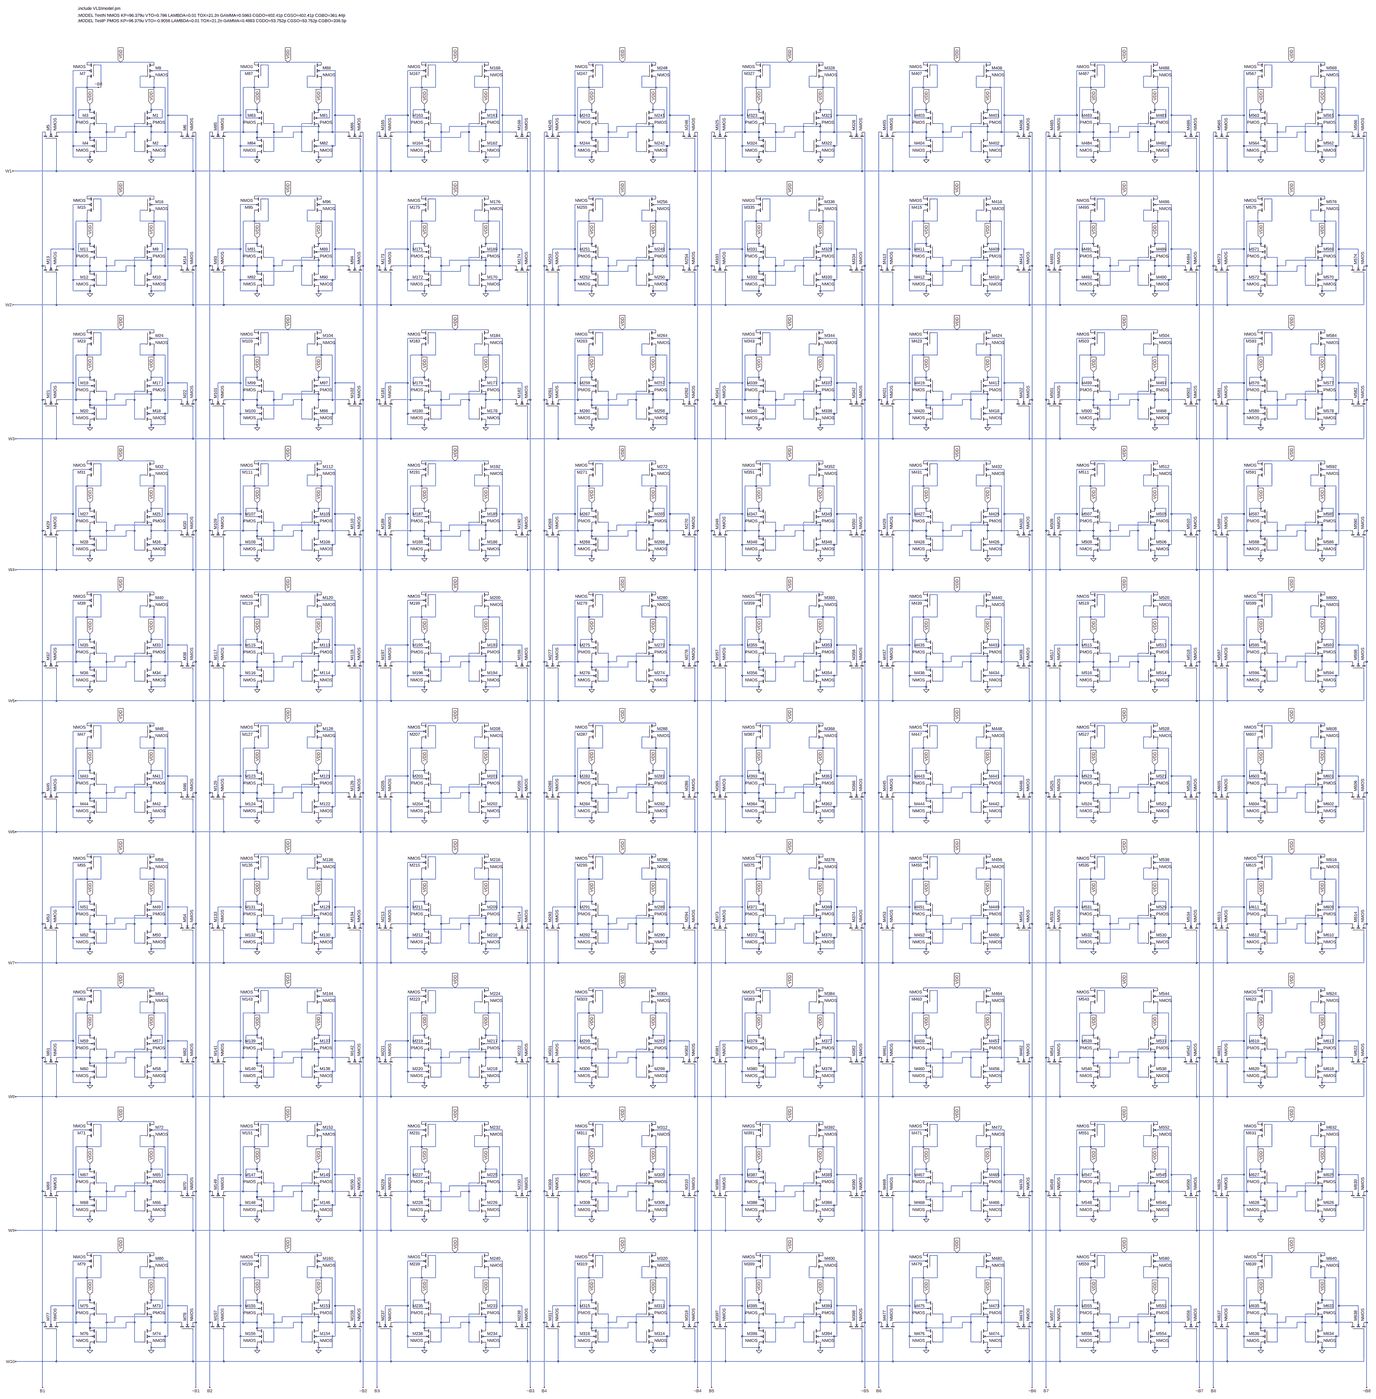
[diagram p0: schematic 40nm RAM - Copy.asc, whole sheet]
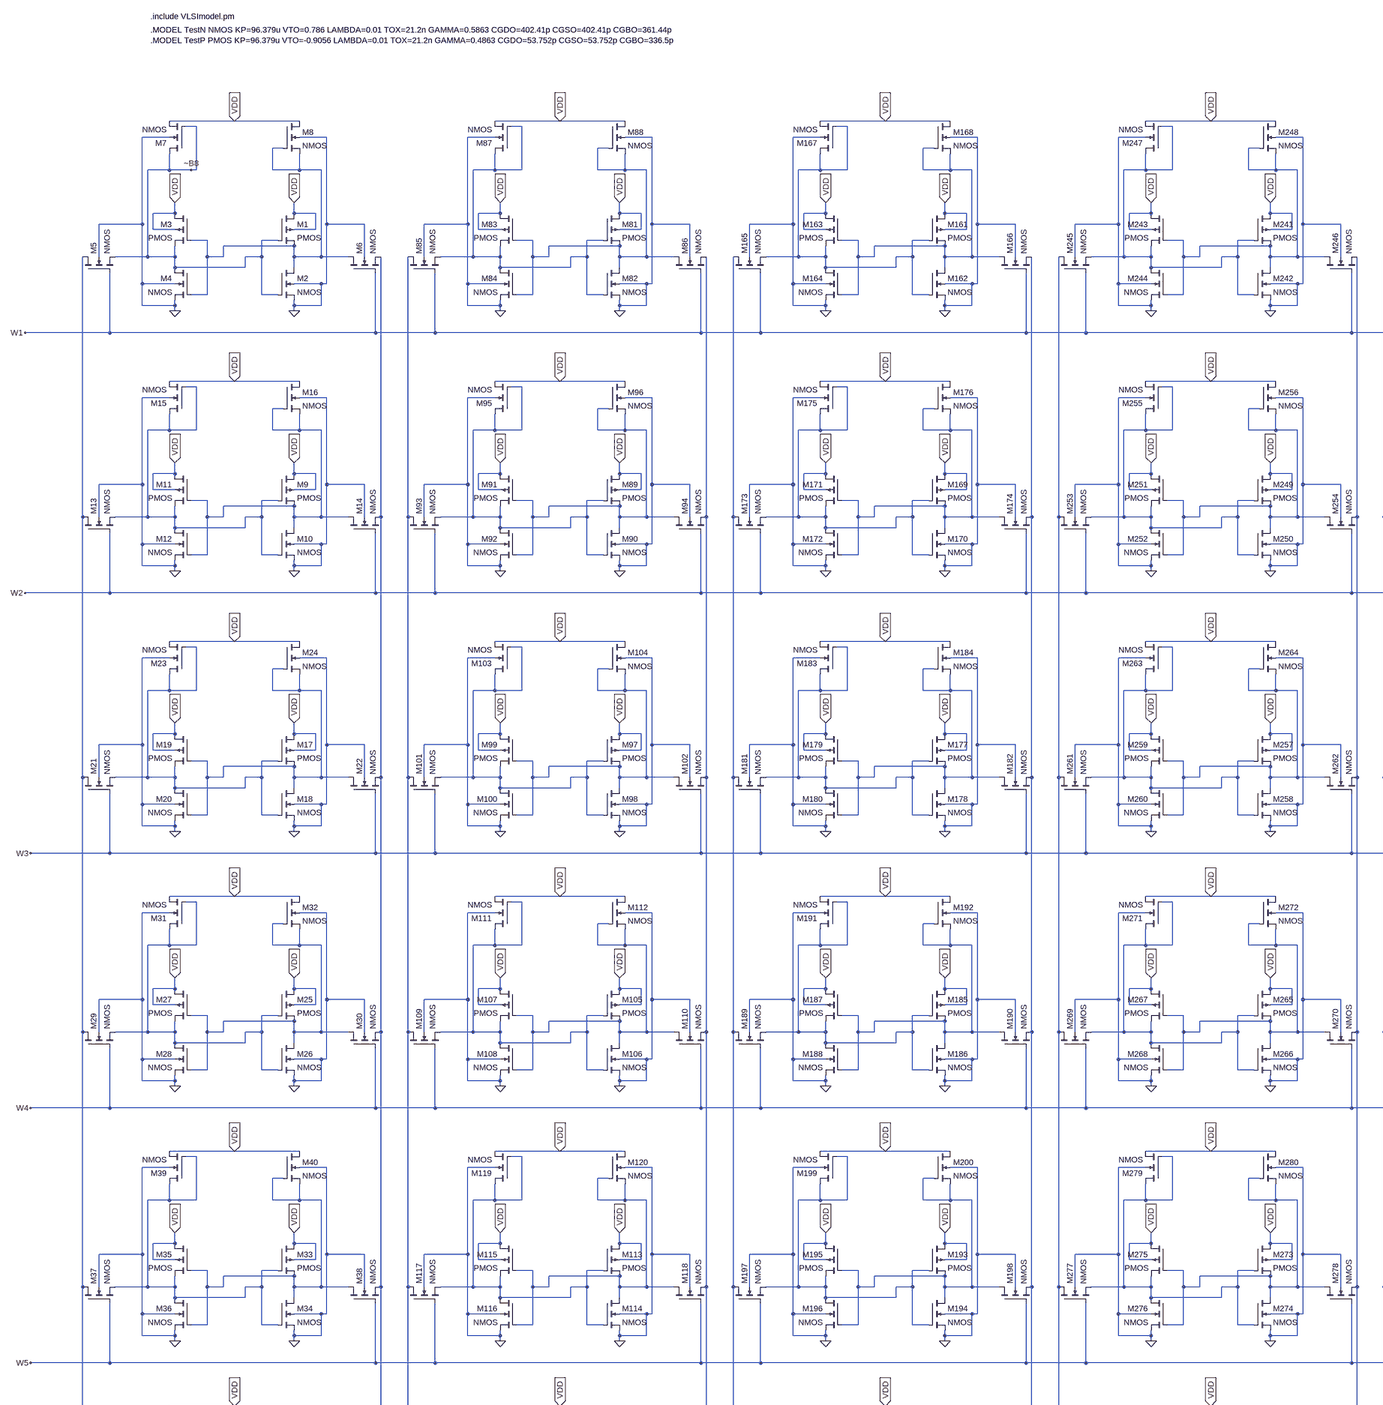
[diagram p1: schematic 40nm RAM - Copy.asc, part, row 1 of 2, column 1 of 2]
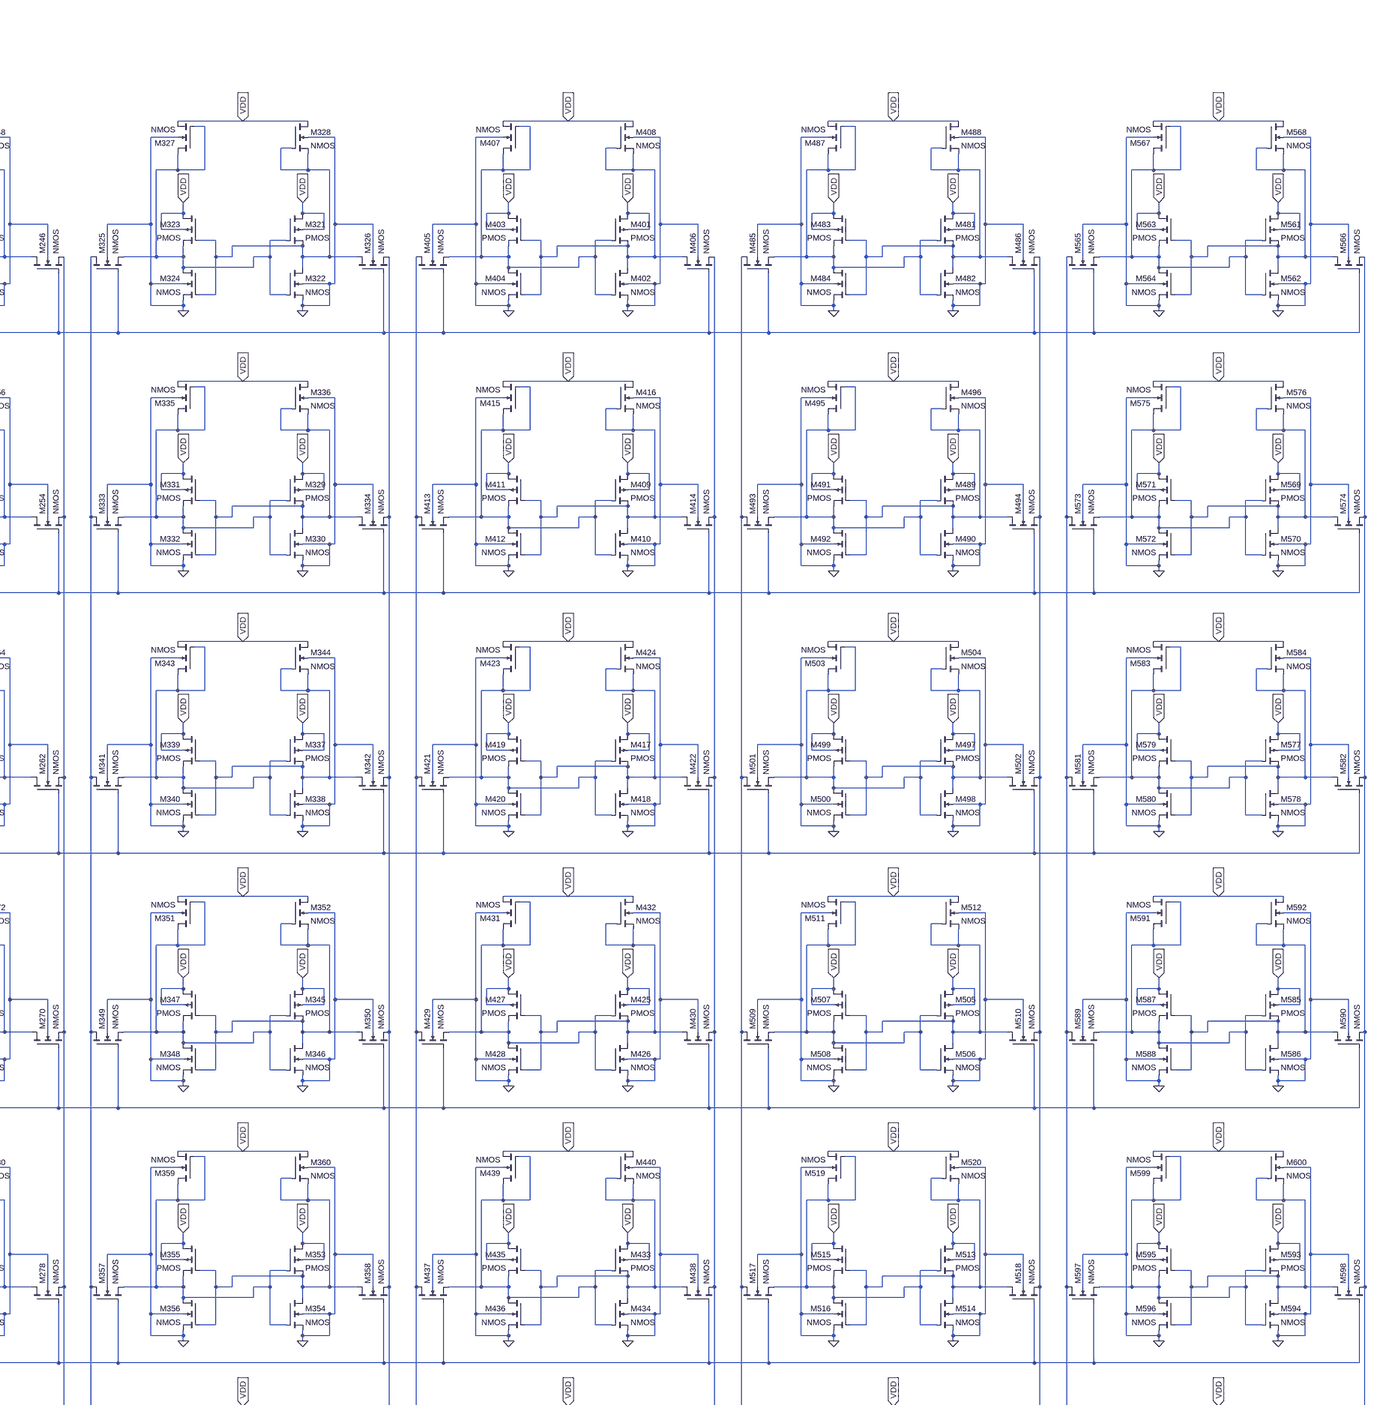
[diagram p2: schematic 40nm RAM - Copy.asc, part, row 1 of 2, column 2 of 2]
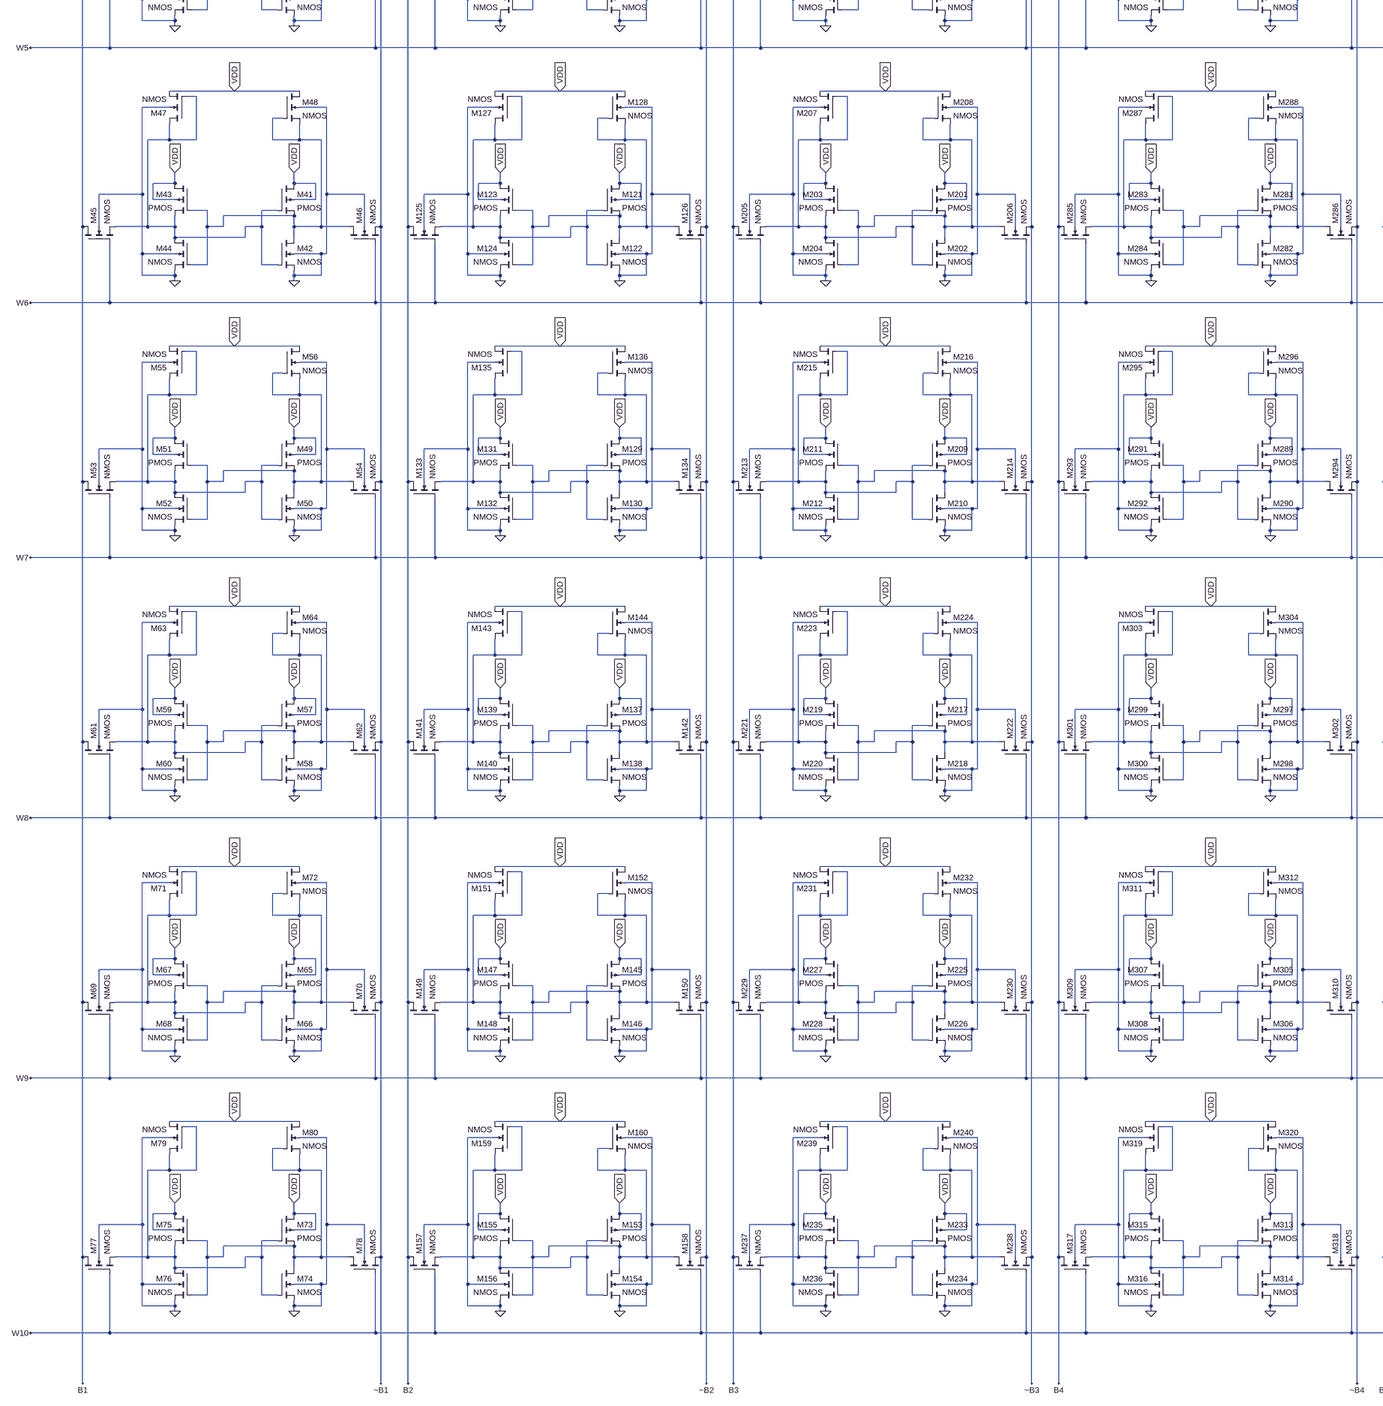
[diagram p3: schematic 40nm RAM - Copy.asc, part, row 2 of 2, column 1 of 2]
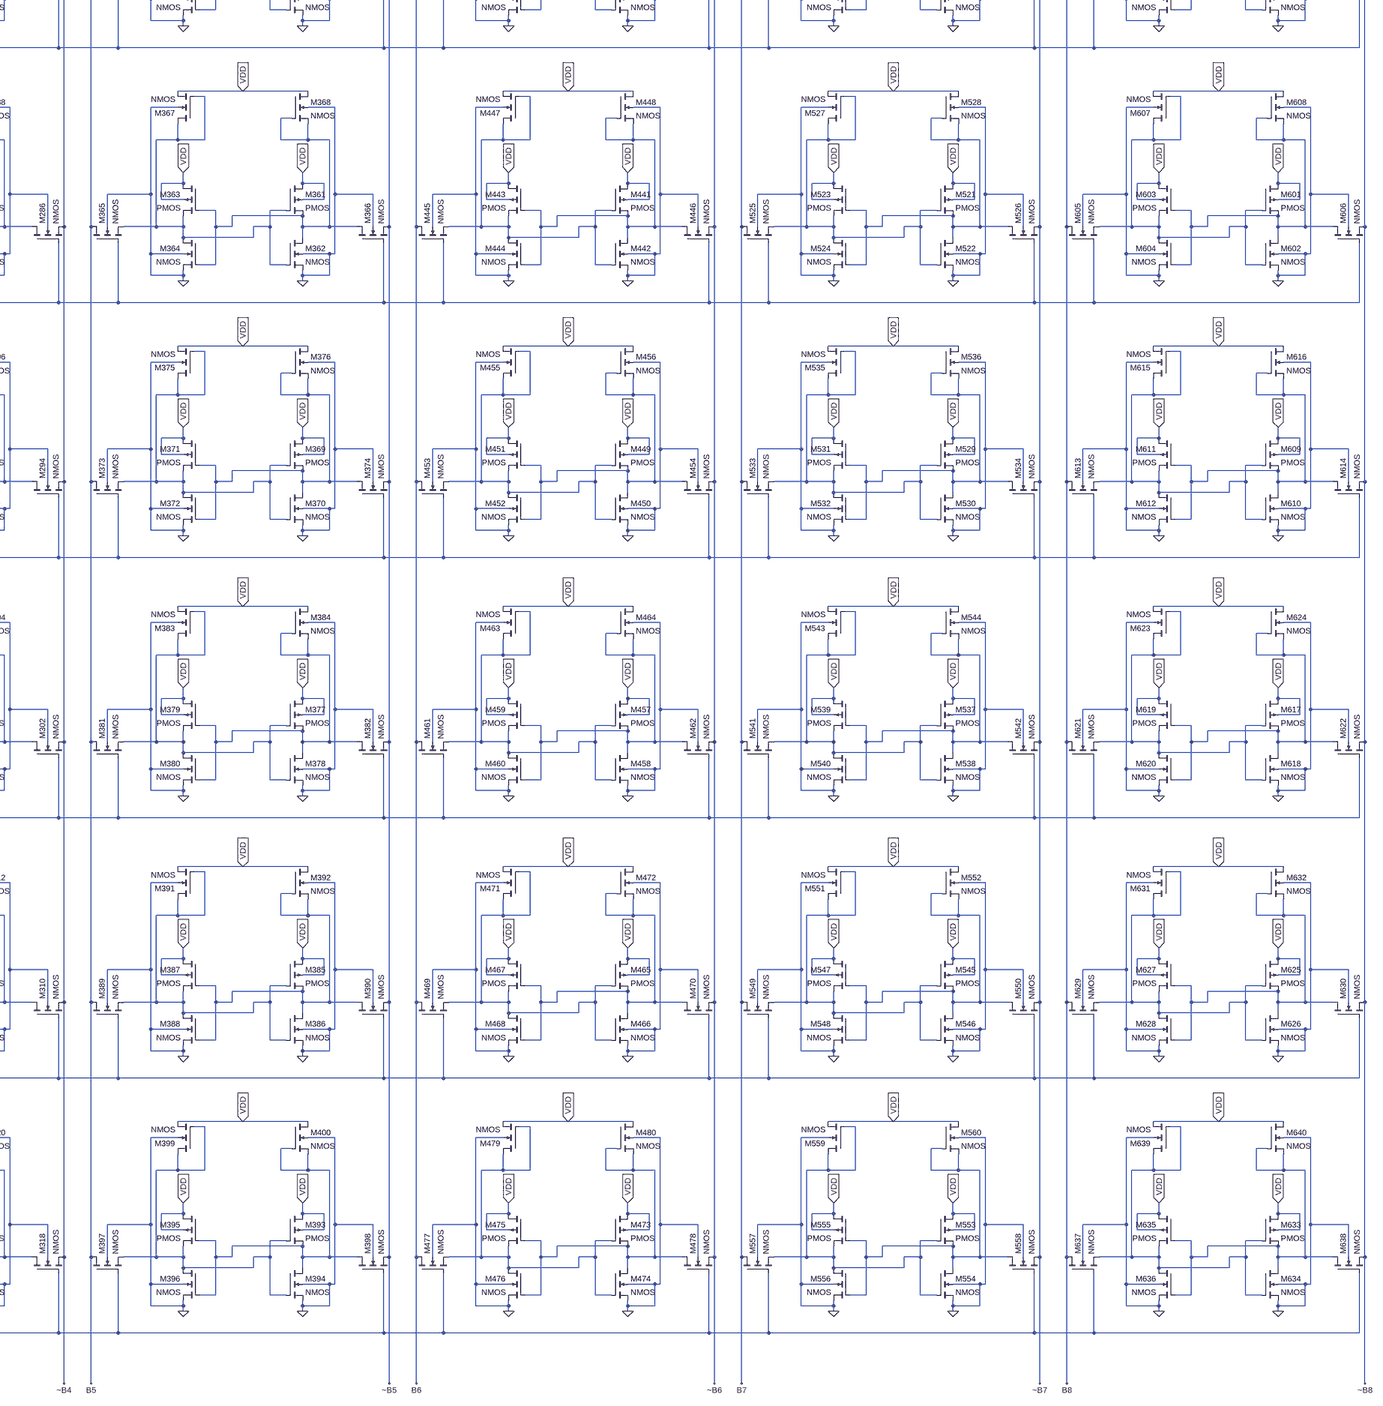
[diagram p4: schematic 40nm RAM - Copy.asc, part, row 2 of 2, column 2 of 2]
* 40nm RAM - Copy.asc
M1 VDD ~B8 N008 VDD PMOS
M2 N008 ~B8 0 0 NMOS
M3 VDD N008 ~B8 VDD PMOS
M4 ~B8 N008 0 0 NMOS
M5 B1 W1 ~B8 0 NMOS
M6 N008 W1 ~B1 0 NMOS
M7 ~B8 ~B8 VDD 0 NMOS
M8 VDD N008 N008 0 NMOS
M9 VDD N016 N024 VDD PMOS
M10 N024 N016 0 0 NMOS
M11 VDD N024 N016 VDD PMOS
M12 N016 N024 0 0 NMOS
M13 B1 W2 N016 0 NMOS
M14 N024 W2 ~B1 0 NMOS
M15 N016 N016 VDD 0 NMOS
M16 VDD N024 N024 0 NMOS
M17 VDD N032 N040 VDD PMOS
M18 N040 N032 0 0 NMOS
M19 VDD N040 N032 VDD PMOS
M20 N032 N040 0 0 NMOS
M21 B1 W3 N032 0 NMOS
M22 N040 W3 ~B1 0 NMOS
M23 N032 N032 VDD 0 NMOS
M24 VDD N040 N040 0 NMOS
M25 VDD N048 N056 VDD PMOS
M26 N056 N048 0 0 NMOS
M27 VDD N056 N048 VDD PMOS
M28 N048 N056 0 0 NMOS
M29 B1 W4 N048 0 NMOS
M30 N056 W4 ~B1 0 NMOS
M31 N048 N048 VDD 0 NMOS
M32 VDD N056 N056 0 NMOS
M33 VDD N064 N072 VDD PMOS
M34 N072 N064 0 0 NMOS
M35 VDD N072 N064 VDD PMOS
M36 N064 N072 0 0 NMOS
M37 B1 W5 N064 0 NMOS
M38 N072 W5 ~B1 0 NMOS
M39 N064 N064 VDD 0 NMOS
M40 VDD N072 N072 0 NMOS
M41 VDD N080 N088 VDD PMOS
M42 N088 N080 0 0 NMOS
M43 VDD N088 N080 VDD PMOS
M44 N080 N088 0 0 NMOS
M45 B1 W6 N080 0 NMOS
M46 N088 W6 ~B1 0 NMOS
M47 N080 N080 VDD 0 NMOS
M48 VDD N088 N088 0 NMOS
M49 VDD N096 N104 VDD PMOS
M50 N104 N096 0 0 NMOS
M51 VDD N104 N096 VDD PMOS
M52 N096 N104 0 0 NMOS
M53 B1 W7 N096 0 NMOS
M54 N104 W7 ~B1 0 NMOS
M55 N096 N096 VDD 0 NMOS
M56 VDD N104 N104 0 NMOS
M57 VDD N112 N120 VDD PMOS
M58 N120 N112 0 0 NMOS
M59 VDD N120 N112 VDD PMOS
M60 N112 N120 0 0 NMOS
M61 B1 W8 N112 0 NMOS
M62 N120 W8 ~B1 0 NMOS
M63 N112 N112 VDD 0 NMOS
M64 VDD N120 N120 0 NMOS
M65 VDD N128 N136 VDD PMOS
M66 N136 N128 0 0 NMOS
M67 VDD N136 N128 VDD PMOS
M68 N128 N136 0 0 NMOS
M69 B1 W9 N128 0 NMOS
M70 N136 W9 ~B1 0 NMOS
M71 N128 N128 VDD 0 NMOS
M72 VDD N136 N136 0 NMOS
M73 VDD N144 N152 VDD PMOS
M74 N152 N144 0 0 NMOS
M75 VDD N152 N144 VDD PMOS
M76 N144 N152 0 0 NMOS
M77 B1 W10 N144 0 NMOS
M78 N152 W10 ~B1 0 NMOS
M79 N144 N144 VDD 0 NMOS
M80 VDD N152 N152 0 NMOS
M81 VDD N001 N009 VDD PMOS
M82 N009 N001 0 0 NMOS
M83 VDD N009 N001 VDD PMOS
M84 N001 N009 0 0 NMOS
M85 B2 W1 N001 0 NMOS
M86 N009 W1 ~B2 0 NMOS
M87 N001 N001 VDD 0 NMOS
M88 VDD N009 N009 0 NMOS
M89 VDD N017 N025 VDD PMOS
M90 N025 N017 0 0 NMOS
M91 VDD N025 N017 VDD PMOS
M92 N017 N025 0 0 NMOS
M93 B2 W2 N017 0 NMOS
M94 N025 W2 ~B2 0 NMOS
M95 N017 N017 VDD 0 NMOS
M96 VDD N025 N025 0 NMOS
M97 VDD N033 N041 VDD PMOS
M98 N041 N033 0 0 NMOS
M99 VDD N041 N033 VDD PMOS
M100 N033 N041 0 0 NMOS
M101 B2 W3 N033 0 NMOS
M102 N041 W3 ~B2 0 NMOS
M103 N033 N033 VDD 0 NMOS
M104 VDD N041 N041 0 NMOS
M105 VDD N049 N057 VDD PMOS
M106 N057 N049 0 0 NMOS
M107 VDD N057 N049 VDD PMOS
M108 N049 N057 0 0 NMOS
M109 B2 W4 N049 0 NMOS
M110 N057 W4 ~B2 0 NMOS
M111 N049 N049 VDD 0 NMOS
M112 VDD N057 N057 0 NMOS
M113 VDD N065 N073 VDD PMOS
M114 N073 N065 0 0 NMOS
M115 VDD N073 N065 VDD PMOS
M116 N065 N073 0 0 NMOS
M117 B2 W5 N065 0 NMOS
M118 N073 W5 ~B2 0 NMOS
M119 N065 N065 VDD 0 NMOS
M120 VDD N073 N073 0 NMOS
M121 VDD N081 N089 VDD PMOS
M122 N089 N081 0 0 NMOS
M123 VDD N089 N081 VDD PMOS
M124 N081 N089 0 0 NMOS
M125 B2 W6 N081 0 NMOS
M126 N089 W6 ~B2 0 NMOS
M127 N081 N081 VDD 0 NMOS
M128 VDD N089 N089 0 NMOS
M129 VDD N097 N105 VDD PMOS
M130 N105 N097 0 0 NMOS
M131 VDD N105 N097 VDD PMOS
M132 N097 N105 0 0 NMOS
M133 B2 W7 N097 0 NMOS
M134 N105 W7 ~B2 0 NMOS
M135 N097 N097 VDD 0 NMOS
M136 VDD N105 N105 0 NMOS
M137 VDD N113 N121 VDD PMOS
M138 N121 N113 0 0 NMOS
M139 VDD N121 N113 VDD PMOS
M140 N113 N121 0 0 NMOS
M141 B2 W8 N113 0 NMOS
M142 N121 W8 ~B2 0 NMOS
M143 N113 N113 VDD 0 NMOS
M144 VDD N121 N121 0 NMOS
M145 VDD N129 N137 VDD PMOS
M146 N137 N129 0 0 NMOS
M147 VDD N137 N129 VDD PMOS
M148 N129 N137 0 0 NMOS
M149 B2 W9 N129 0 NMOS
M150 N137 W9 ~B2 0 NMOS
M151 N129 N129 VDD 0 NMOS
M152 VDD N137 N137 0 NMOS
M153 VDD N145 N153 VDD PMOS
M154 N153 N145 0 0 NMOS
M155 VDD N153 N145 VDD PMOS
M156 N145 N153 0 0 NMOS
M157 B2 W10 N145 0 NMOS
M158 N153 W10 ~B2 0 NMOS
M159 N145 N145 VDD 0 NMOS
M160 VDD N153 N153 0 NMOS
M161 VDD N002 N010 VDD PMOS
M162 N010 N002 0 0 NMOS
M163 VDD N010 N002 VDD PMOS
M164 N002 N010 0 0 NMOS
M165 B3 W1 N002 0 NMOS
M166 N010 W1 ~B3 0 NMOS
M167 N002 N002 VDD 0 NMOS
M168 VDD N010 N010 0 NMOS
M169 VDD N018 N026 VDD PMOS
M170 N026 N018 0 0 NMOS
M171 VDD N026 N018 VDD PMOS
M172 N018 N026 0 0 NMOS
M173 B3 W2 N018 0 NMOS
M174 N026 W2 ~B3 0 NMOS
M175 N018 N018 VDD 0 NMOS
M176 VDD N026 N026 0 NMOS
M177 VDD N034 N042 VDD PMOS
M178 N042 N034 0 0 NMOS
M179 VDD N042 N034 VDD PMOS
M180 N034 N042 0 0 NMOS
M181 B3 W3 N034 0 NMOS
M182 N042 W3 ~B3 0 NMOS
M183 N034 N034 VDD 0 NMOS
M184 VDD N042 N042 0 NMOS
M185 VDD N050 N058 VDD PMOS
M186 N058 N050 0 0 NMOS
M187 VDD N058 N050 VDD PMOS
M188 N050 N058 0 0 NMOS
M189 B3 W4 N050 0 NMOS
M190 N058 W4 ~B3 0 NMOS
M191 N050 N050 VDD 0 NMOS
M192 VDD N058 N058 0 NMOS
M193 VDD N066 N074 VDD PMOS
M194 N074 N066 0 0 NMOS
M195 VDD N074 N066 VDD PMOS
M196 N066 N074 0 0 NMOS
M197 B3 W5 N066 0 NMOS
M198 N074 W5 ~B3 0 NMOS
M199 N066 N066 VDD 0 NMOS
M200 VDD N074 N074 0 NMOS
M201 VDD N082 N090 VDD PMOS
M202 N090 N082 0 0 NMOS
M203 VDD N090 N082 VDD PMOS
M204 N082 N090 0 0 NMOS
M205 B3 W6 N082 0 NMOS
M206 N090 W6 ~B3 0 NMOS
M207 N082 N082 VDD 0 NMOS
M208 VDD N090 N090 0 NMOS
M209 VDD N098 N106 VDD PMOS
M210 N106 N098 0 0 NMOS
M211 VDD N106 N098 VDD PMOS
M212 N098 N106 0 0 NMOS
M213 B3 W7 N098 0 NMOS
M214 N106 W7 ~B3 0 NMOS
M215 N098 N098 VDD 0 NMOS
M216 VDD N106 N106 0 NMOS
M217 VDD N114 N122 VDD PMOS
M218 N122 N114 0 0 NMOS
M219 VDD N122 N114 VDD PMOS
M220 N114 N122 0 0 NMOS
M221 B3 W8 N114 0 NMOS
M222 N122 W8 ~B3 0 NMOS
M223 N114 N114 VDD 0 NMOS
M224 VDD N122 N122 0 NMOS
M225 VDD N130 N138 VDD PMOS
M226 N138 N130 0 0 NMOS
M227 VDD N138 N130 VDD PMOS
M228 N130 N138 0 0 NMOS
M229 B3 W9 N130 0 NMOS
M230 N138 W9 ~B3 0 NMOS
M231 N130 N130 VDD 0 NMOS
M232 VDD N138 N138 0 NMOS
M233 VDD N146 N154 VDD PMOS
M234 N154 N146 0 0 NMOS
M235 VDD N154 N146 VDD PMOS
M236 N146 N154 0 0 NMOS
M237 B3 W10 N146 0 NMOS
M238 N154 W10 ~B3 0 NMOS
M239 N146 N146 VDD 0 NMOS
M240 VDD N154 N154 0 NMOS
M241 VDD N003 N011 VDD PMOS
M242 N011 N003 0 0 NMOS
M243 VDD N011 N003 VDD PMOS
M244 N003 N011 0 0 NMOS
M245 B4 W1 N003 0 NMOS
M246 N011 W1 ~B4 0 NMOS
M247 N003 N003 VDD 0 NMOS
M248 VDD N011 N011 0 NMOS
M249 VDD N019 N027 VDD PMOS
M250 N027 N019 0 0 NMOS
M251 VDD N027 N019 VDD PMOS
M252 N019 N027 0 0 NMOS
M253 B4 W2 N019 0 NMOS
M254 N027 W2 ~B4 0 NMOS
M255 N019 N019 VDD 0 NMOS
M256 VDD N027 N027 0 NMOS
M257 VDD N035 N043 VDD PMOS
M258 N043 N035 0 0 NMOS
M259 VDD N043 N035 VDD PMOS
M260 N035 N043 0 0 NMOS
M261 B4 W3 N035 0 NMOS
M262 N043 W3 ~B4 0 NMOS
M263 N035 N035 VDD 0 NMOS
M264 VDD N043 N043 0 NMOS
M265 VDD N051 N059 VDD PMOS
M266 N059 N051 0 0 NMOS
M267 VDD N059 N051 VDD PMOS
M268 N051 N059 0 0 NMOS
M269 B4 W4 N051 0 NMOS
M270 N059 W4 ~B4 0 NMOS
M271 N051 N051 VDD 0 NMOS
M272 VDD N059 N059 0 NMOS
M273 VDD N067 N075 VDD PMOS
M274 N075 N067 0 0 NMOS
M275 VDD N075 N067 VDD PMOS
M276 N067 N075 0 0 NMOS
M277 B4 W5 N067 0 NMOS
M278 N075 W5 ~B4 0 NMOS
M279 N067 N067 VDD 0 NMOS
M280 VDD N075 N075 0 NMOS
M281 VDD N083 N091 VDD PMOS
M282 N091 N083 0 0 NMOS
M283 VDD N091 N083 VDD PMOS
M284 N083 N091 0 0 NMOS
M285 B4 W6 N083 0 NMOS
M286 N091 W6 ~B4 0 NMOS
M287 N083 N083 VDD 0 NMOS
M288 VDD N091 N091 0 NMOS
M289 VDD N099 N107 VDD PMOS
M290 N107 N099 0 0 NMOS
M291 VDD N107 N099 VDD PMOS
M292 N099 N107 0 0 NMOS
M293 B4 W7 N099 0 NMOS
M294 N107 W7 ~B4 0 NMOS
M295 N099 N099 VDD 0 NMOS
M296 VDD N107 N107 0 NMOS
M297 VDD N115 N123 VDD PMOS
M298 N123 N115 0 0 NMOS
M299 VDD N123 N115 VDD PMOS
M300 N115 N123 0 0 NMOS
M301 B4 W8 N115 0 NMOS
M302 N123 W8 ~B4 0 NMOS
M303 N115 N115 VDD 0 NMOS
M304 VDD N123 N123 0 NMOS
M305 VDD N131 N139 VDD PMOS
M306 N139 N131 0 0 NMOS
M307 VDD N139 N131 VDD PMOS
M308 N131 N139 0 0 NMOS
M309 B4 W9 N131 0 NMOS
M310 N139 W9 ~B4 0 NMOS
M311 N131 N131 VDD 0 NMOS
M312 VDD N139 N139 0 NMOS
M313 VDD N147 N155 VDD PMOS
M314 N155 N147 0 0 NMOS
M315 VDD N155 N147 VDD PMOS
M316 N147 N155 0 0 NMOS
M317 B4 W10 N147 0 NMOS
M318 N155 W10 ~B4 0 NMOS
M319 N147 N147 VDD 0 NMOS
M320 VDD N155 N155 0 NMOS
M321 VDD N004 N012 VDD PMOS
M322 N012 N004 0 0 NMOS
M323 VDD N012 N004 VDD PMOS
M324 N004 N012 0 0 NMOS
M325 B5 W1 N004 0 NMOS
M326 N012 W1 ~B5 0 NMOS
M327 N004 N004 VDD 0 NMOS
M328 VDD N012 N012 0 NMOS
M329 VDD N020 N028 VDD PMOS
M330 N028 N020 0 0 NMOS
M331 VDD N028 N020 VDD PMOS
M332 N020 N028 0 0 NMOS
M333 B5 W2 N020 0 NMOS
M334 N028 W2 ~B5 0 NMOS
M335 N020 N020 VDD 0 NMOS
M336 VDD N028 N028 0 NMOS
M337 VDD N036 N044 VDD PMOS
M338 N044 N036 0 0 NMOS
M339 VDD N044 N036 VDD PMOS
M340 N036 N044 0 0 NMOS
M341 B5 W3 N036 0 NMOS
M342 N044 W3 ~B5 0 NMOS
M343 N036 N036 VDD 0 NMOS
M344 VDD N044 N044 0 NMOS
M345 VDD N052 N060 VDD PMOS
M346 N060 N052 0 0 NMOS
M347 VDD N060 N052 VDD PMOS
M348 N052 N060 0 0 NMOS
M349 B5 W4 N052 0 NMOS
M350 N060 W4 ~B5 0 NMOS
M351 N052 N052 VDD 0 NMOS
M352 VDD N060 N060 0 NMOS
M353 VDD N068 N076 VDD PMOS
M354 N076 N068 0 0 NMOS
M355 VDD N076 N068 VDD PMOS
M356 N068 N076 0 0 NMOS
M357 B5 W5 N068 0 NMOS
M358 N076 W5 ~B5 0 NMOS
M359 N068 N068 VDD 0 NMOS
M360 VDD N076 N076 0 NMOS
M361 VDD N084 N092 VDD PMOS
M362 N092 N084 0 0 NMOS
M363 VDD N092 N084 VDD PMOS
M364 N084 N092 0 0 NMOS
M365 B5 W6 N084 0 NMOS
M366 N092 W6 ~B5 0 NMOS
M367 N084 N084 VDD 0 NMOS
M368 VDD N092 N092 0 NMOS
M369 VDD N100 N108 VDD PMOS
M370 N108 N100 0 0 NMOS
M371 VDD N108 N100 VDD PMOS
M372 N100 N108 0 0 NMOS
M373 B5 W7 N100 0 NMOS
M374 N108 W7 ~B5 0 NMOS
M375 N100 N100 VDD 0 NMOS
M376 VDD N108 N108 0 NMOS
M377 VDD N116 N124 VDD PMOS
M378 N124 N116 0 0 NMOS
M379 VDD N124 N116 VDD PMOS
M380 N116 N124 0 0 NMOS
M381 B5 W8 N116 0 NMOS
M382 N124 W8 ~B5 0 NMOS
M383 N116 N116 VDD 0 NMOS
M384 VDD N124 N124 0 NMOS
M385 VDD N132 N140 VDD PMOS
M386 N140 N132 0 0 NMOS
M387 VDD N140 N132 VDD PMOS
M388 N132 N140 0 0 NMOS
M389 B5 W9 N132 0 NMOS
M390 N140 W9 ~B5 0 NMOS
M391 N132 N132 VDD 0 NMOS
M392 VDD N140 N140 0 NMOS
M393 VDD N148 N156 VDD PMOS
M394 N156 N148 0 0 NMOS
M395 VDD N156 N148 VDD PMOS
M396 N148 N156 0 0 NMOS
M397 B5 W10 N148 0 NMOS
M398 N156 W10 ~B5 0 NMOS
M399 N148 N148 VDD 0 NMOS
M400 VDD N156 N156 0 NMOS
M401 VDD N005 N013 VDD PMOS
M402 N013 N005 0 0 NMOS
M403 VDD N013 N005 VDD PMOS
M404 N005 N013 0 0 NMOS
M405 B6 W1 N005 0 NMOS
M406 N013 W1 ~B6 0 NMOS
M407 N005 N005 VDD 0 NMOS
M408 VDD N013 N013 0 NMOS
M409 VDD N021 N029 VDD PMOS
M410 N029 N021 0 0 NMOS
M411 VDD N029 N021 VDD PMOS
M412 N021 N029 0 0 NMOS
M413 B6 W2 N021 0 NMOS
M414 N029 W2 ~B6 0 NMOS
M415 N021 N021 VDD 0 NMOS
M416 VDD N029 N029 0 NMOS
M417 VDD N037 N045 VDD PMOS
M418 N045 N037 0 0 NMOS
M419 VDD N045 N037 VDD PMOS
M420 N037 N045 0 0 NMOS
M421 B6 W3 N037 0 NMOS
M422 N045 W3 ~B6 0 NMOS
M423 N037 N037 VDD 0 NMOS
M424 VDD N045 N045 0 NMOS
M425 VDD N053 N061 VDD PMOS
M426 N061 N053 0 0 NMOS
M427 VDD N061 N053 VDD PMOS
M428 N053 N061 0 0 NMOS
M429 B6 W4 N053 0 NMOS
M430 N061 W4 ~B6 0 NMOS
M431 N053 N053 VDD 0 NMOS
M432 VDD N061 N061 0 NMOS
M433 VDD N069 N077 VDD PMOS
M434 N077 N069 0 0 NMOS
M435 VDD N077 N069 VDD PMOS
M436 N069 N077 0 0 NMOS
M437 B6 W5 N069 0 NMOS
M438 N077 W5 ~B6 0 NMOS
M439 N069 N069 VDD 0 NMOS
M440 VDD N077 N077 0 NMOS
M441 VDD N085 N093 VDD PMOS
M442 N093 N085 0 0 NMOS
M443 VDD N093 N085 VDD PMOS
M444 N085 N093 0 0 NMOS
M445 B6 W6 N085 0 NMOS
M446 N093 W6 ~B6 0 NMOS
M447 N085 N085 VDD 0 NMOS
M448 VDD N093 N093 0 NMOS
M449 VDD N101 N109 VDD PMOS
M450 N109 N101 0 0 NMOS
M451 VDD N109 N101 VDD PMOS
M452 N101 N109 0 0 NMOS
M453 B6 W7 N101 0 NMOS
M454 N109 W7 ~B6 0 NMOS
M455 N101 N101 VDD 0 NMOS
M456 VDD N109 N109 0 NMOS
M457 VDD N117 N125 VDD PMOS
M458 N125 N117 0 0 NMOS
M459 VDD N125 N117 VDD PMOS
M460 N117 N125 0 0 NMOS
M461 B6 W8 N117 0 NMOS
M462 N125 W8 ~B6 0 NMOS
M463 N117 N117 VDD 0 NMOS
M464 VDD N125 N125 0 NMOS
M465 VDD N133 N141 VDD PMOS
M466 N141 N133 0 0 NMOS
M467 VDD N141 N133 VDD PMOS
M468 N133 N141 0 0 NMOS
M469 B6 W9 N133 0 NMOS
M470 N141 W9 ~B6 0 NMOS
M471 N133 N133 VDD 0 NMOS
M472 VDD N141 N141 0 NMOS
M473 VDD N149 N157 VDD PMOS
M474 N157 N149 0 0 NMOS
M475 VDD N157 N149 VDD PMOS
M476 N149 N157 0 0 NMOS
M477 B6 W10 N149 0 NMOS
M478 N157 W10 ~B6 0 NMOS
M479 N149 N149 VDD 0 NMOS
M480 VDD N157 N157 0 NMOS
M481 VDD N006 N014 VDD PMOS
M482 N014 N006 0 0 NMOS
M483 VDD N014 N006 VDD PMOS
M484 N006 N014 0 0 NMOS
M485 B7 W1 N006 0 NMOS
M486 N014 W1 ~B7 0 NMOS
M487 N006 N006 VDD 0 NMOS
M488 VDD N014 N014 0 NMOS
M489 VDD N022 N030 VDD PMOS
M490 N030 N022 0 0 NMOS
M491 VDD N030 N022 VDD PMOS
M492 N022 N030 0 0 NMOS
M493 B7 W2 N022 0 NMOS
M494 N030 W2 ~B7 0 NMOS
M495 N022 N022 VDD 0 NMOS
M496 VDD N030 N030 0 NMOS
M497 VDD N038 N046 VDD PMOS
M498 N046 N038 0 0 NMOS
M499 VDD N046 N038 VDD PMOS
M500 N038 N046 0 0 NMOS
M501 B7 W3 N038 0 NMOS
M502 N046 W3 ~B7 0 NMOS
M503 N038 N038 VDD 0 NMOS
M504 VDD N046 N046 0 NMOS
M505 VDD N054 N062 VDD PMOS
M506 N062 N054 0 0 NMOS
M507 VDD N062 N054 VDD PMOS
M508 N054 N062 0 0 NMOS
M509 B7 W4 N054 0 NMOS
M510 N062 W4 ~B7 0 NMOS
M511 N054 N054 VDD 0 NMOS
M512 VDD N062 N062 0 NMOS
M513 VDD N070 N078 VDD PMOS
M514 N078 N070 0 0 NMOS
M515 VDD N078 N070 VDD PMOS
M516 N070 N078 0 0 NMOS
M517 B7 W5 N070 0 NMOS
M518 N078 W5 ~B7 0 NMOS
M519 N070 N070 VDD 0 NMOS
M520 VDD N078 N078 0 NMOS
M521 VDD N086 N094 VDD PMOS
M522 N094 N086 0 0 NMOS
M523 VDD N094 N086 VDD PMOS
M524 N086 N094 0 0 NMOS
M525 B7 W6 N086 0 NMOS
M526 N094 W6 ~B7 0 NMOS
M527 N086 N086 VDD 0 NMOS
M528 VDD N094 N094 0 NMOS
M529 VDD N102 N110 VDD PMOS
M530 N110 N102 0 0 NMOS
M531 VDD N110 N102 VDD PMOS
M532 N102 N110 0 0 NMOS
M533 B7 W7 N102 0 NMOS
M534 N110 W7 ~B7 0 NMOS
M535 N102 N102 VDD 0 NMOS
M536 VDD N110 N110 0 NMOS
M537 VDD N118 N126 VDD PMOS
M538 N126 N118 0 0 NMOS
M539 VDD N126 N118 VDD PMOS
M540 N118 N126 0 0 NMOS
M541 B7 W8 N118 0 NMOS
M542 N126 W8 ~B7 0 NMOS
M543 N118 N118 VDD 0 NMOS
M544 VDD N126 N126 0 NMOS
M545 VDD N134 N142 VDD PMOS
M546 N142 N134 0 0 NMOS
M547 VDD N142 N134 VDD PMOS
M548 N134 N142 0 0 NMOS
M549 B7 W9 N134 0 NMOS
M550 N142 W9 ~B7 0 NMOS
M551 N134 N134 VDD 0 NMOS
M552 VDD N142 N142 0 NMOS
M553 VDD N150 N158 VDD PMOS
M554 N158 N150 0 0 NMOS
M555 VDD N158 N150 VDD PMOS
M556 N150 N158 0 0 NMOS
M557 B7 W10 N150 0 NMOS
M558 N158 W10 ~B7 0 NMOS
M559 N150 N150 VDD 0 NMOS
M560 VDD N158 N158 0 NMOS
M561 VDD N007 N015 VDD PMOS
M562 N015 N007 0 0 NMOS
M563 VDD N015 N007 VDD PMOS
M564 N007 N015 0 0 NMOS
M565 B8 W1 N007 0 NMOS
M566 N015 W1 ~B8 0 NMOS
M567 N007 N007 VDD 0 NMOS
M568 VDD N015 N015 0 NMOS
M569 VDD N023 N031 VDD PMOS
M570 N031 N023 0 0 NMOS
M571 VDD N031 N023 VDD PMOS
M572 N023 N031 0 0 NMOS
M573 B8 W2 N023 0 NMOS
M574 N031 W2 ~B8 0 NMOS
M575 N023 N023 VDD 0 NMOS
M576 VDD N031 N031 0 NMOS
M577 VDD N039 N047 VDD PMOS
M578 N047 N039 0 0 NMOS
M579 VDD N047 N039 VDD PMOS
M580 N039 N047 0 0 NMOS
M581 B8 W3 N039 0 NMOS
M582 N047 W3 ~B8 0 NMOS
M583 N039 N039 VDD 0 NMOS
M584 VDD N047 N047 0 NMOS
M585 VDD N055 N063 VDD PMOS
M586 N063 N055 0 0 NMOS
M587 VDD N063 N055 VDD PMOS
M588 N055 N063 0 0 NMOS
M589 B8 W4 N055 0 NMOS
M590 N063 W4 ~B8 0 NMOS
M591 N055 N055 VDD 0 NMOS
M592 VDD N063 N063 0 NMOS
M593 VDD N071 N079 VDD PMOS
M594 N079 N071 0 0 NMOS
M595 VDD N079 N071 VDD PMOS
M596 N071 N079 0 0 NMOS
M597 B8 W5 N071 0 NMOS
M598 N079 W5 ~B8 0 NMOS
M599 N071 N071 VDD 0 NMOS
M600 VDD N079 N079 0 NMOS
M601 VDD N087 N095 VDD PMOS
M602 N095 N087 0 0 NMOS
M603 VDD N095 N087 VDD PMOS
M604 N087 N095 0 0 NMOS
M605 B8 W6 N087 0 NMOS
M606 N095 W6 ~B8 0 NMOS
M607 N087 N087 VDD 0 NMOS
M608 VDD N095 N095 0 NMOS
M609 VDD N103 N111 VDD PMOS
M610 N111 N103 0 0 NMOS
M611 VDD N111 N103 VDD PMOS
M612 N103 N111 0 0 NMOS
M613 B8 W7 N103 0 NMOS
M614 N111 W7 ~B8 0 NMOS
M615 N103 N103 VDD 0 NMOS
M616 VDD N111 N111 0 NMOS
M617 VDD N119 N127 VDD PMOS
M618 N127 N119 0 0 NMOS
M619 VDD N127 N119 VDD PMOS
M620 N119 N127 0 0 NMOS
M621 B8 W8 N119 0 NMOS
M622 N127 W8 ~B8 0 NMOS
M623 N119 N119 VDD 0 NMOS
M624 VDD N127 N127 0 NMOS
M625 VDD N135 N143 VDD PMOS
M626 N143 N135 0 0 NMOS
M627 VDD N143 N135 VDD PMOS
M628 N135 N143 0 0 NMOS
M629 B8 W9 N135 0 NMOS
M630 N143 W9 ~B8 0 NMOS
M631 N135 N135 VDD 0 NMOS
M632 VDD N143 N143 0 NMOS
M633 VDD N151 N159 VDD PMOS
M634 N159 N151 0 0 NMOS
M635 VDD N159 N151 VDD PMOS
M636 N151 N159 0 0 NMOS
M637 B8 W10 N151 0 NMOS
M638 N159 W10 ~B8 0 NMOS
M639 N151 N151 VDD 0 NMOS
M640 VDD N159 N159 0 NMOS
.model NMOS NMOS
.model PMOS PMOS
.lib standard.mos
.include VLSImodel.pm
.MODEL TestN NMOS KP=96.379u VTO=0.786 LAMBDA=0.01 TOX=21.2n GAMMA=0.5863 CGDO=402.41p CGSO=402.41p CGBO=361.44p
.MODEL TestP PMOS KP=96.379u VTO=-0.9056 LAMBDA=0.01 TOX=21.2n GAMMA=0.4863 CGDO=53.752p CGSO=53.752p CGBO=336.5p
.backanno
.end